# Altium schematic sheet LED_STATUS.SchDoc
size A4; SheetNumber: 3; SheetTotal: 3
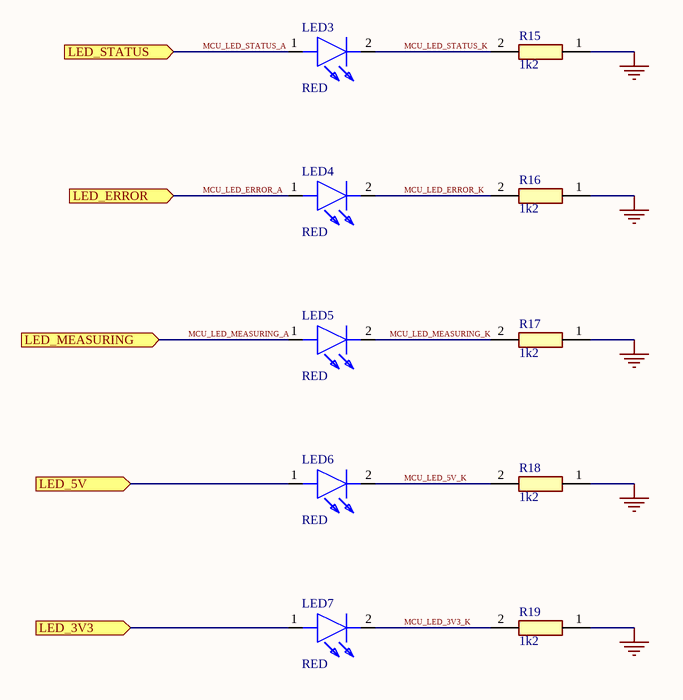
[diagram p0: LED_STATUS.SchDoc]

## Parts
LED3  RED  [APT2012SECKJ3PRV]
LED4  RED  [APT2012SECKJ3PRV]
LED5  RED  [APT2012SECKJ3PRV]
LED6  RED  [APT2012SECKJ3PRV]
LED7  RED  [APT2012SECKJ3PRV]
R15  1k2  [RESC1608X55N]
R16  1k2  [RESC1608X55N]
R17  1k2  [RESC1608X55N]
R18  1k2  [RESC1608X55N]
R19  1k2  [RESC1608X55N]

## Ports
LED_3V3 (in), LED_5V (in), LED_ERROR (in), LED_MEASURING (in), LED_STATUS (in)

## Nets
GND: R15.1 R16.1 R17.1 R18.1 R19.1
LED_3V3: LED7.1(A) ; port LED_3V3
LED_5V: LED6.1(A) ; port LED_5V
MCU_LED_3V3_K: LED7.2(K) R19.2
MCU_LED_5V_K: LED6.2(K) R18.2
MCU_LED_ERROR_A: LED4.1(A) ; port LED_ERROR
MCU_LED_ERROR_K: LED4.2(K) R16.2
MCU_LED_MEASURING_A: LED5.1(A) ; port LED_MEASURING
MCU_LED_MEASURING_K: LED5.2(K) R17.2
MCU_LED_STATUS_A: LED3.1(A) ; port LED_STATUS
MCU_LED_STATUS_K: LED3.2(K) R15.2

## Library data of the parts
LED3-LED7 = APT2012SECK_J3-PRV: LED; Manufacturer_Name: Kingbright; Manufacturer_Part_Number: APT2012SECK/J3-PRV; Datasheet Link: https://www.mouser.de/datasheet/2/216/APT2012SECK-J3-PRV-1173389.pdf; Height: 0.85mm; Mouser Part Number: 604-APT2012SECKJ3PRV; Mouser Price/Stock: https://www.mouser.co.uk/ProductDetail/Kingbright/APT2012SECK-J3-PRV?qs=D2TOvUWgdJ6T9J6WfI%252BQOg%3D%3D; Arrow Part Number: APT2012SECK/J3-PRV; Arrow Price/Stock: https://www.arrow.com/en/products/apt2012seckj3-prv/kingbright?region=nac
R15-R19 = RK73B1JTTD103J: Resistor; Manufacturer_Name: KOA Speer; Datasheet Link: http://www.koaspeer.com/catimages/Products/RK73-RT/RK73-RT.pdf; Height: 0.55mm; Manufacturer_Part_Number: RK73B1JTTD103J; Mouser Part Number: 660-RK73B1JTTD103J; Mouser Price/Stock: https://www.mouser.co.uk/ProductDetail/KOA-Speer/RK73B1JTTD103J?qs=hmtrJ2UjXcBKRTcwO9LloQ%3D%3D; Arrow Part Number: RK73B1JTTD103J; Arrow Price/Stock: https://www.arrow.com/en/products/rk73b1jttd103j/koa-speer-electronics?region=asia